# Altium schematic sheet 发送端V03.SchDoc
size A3
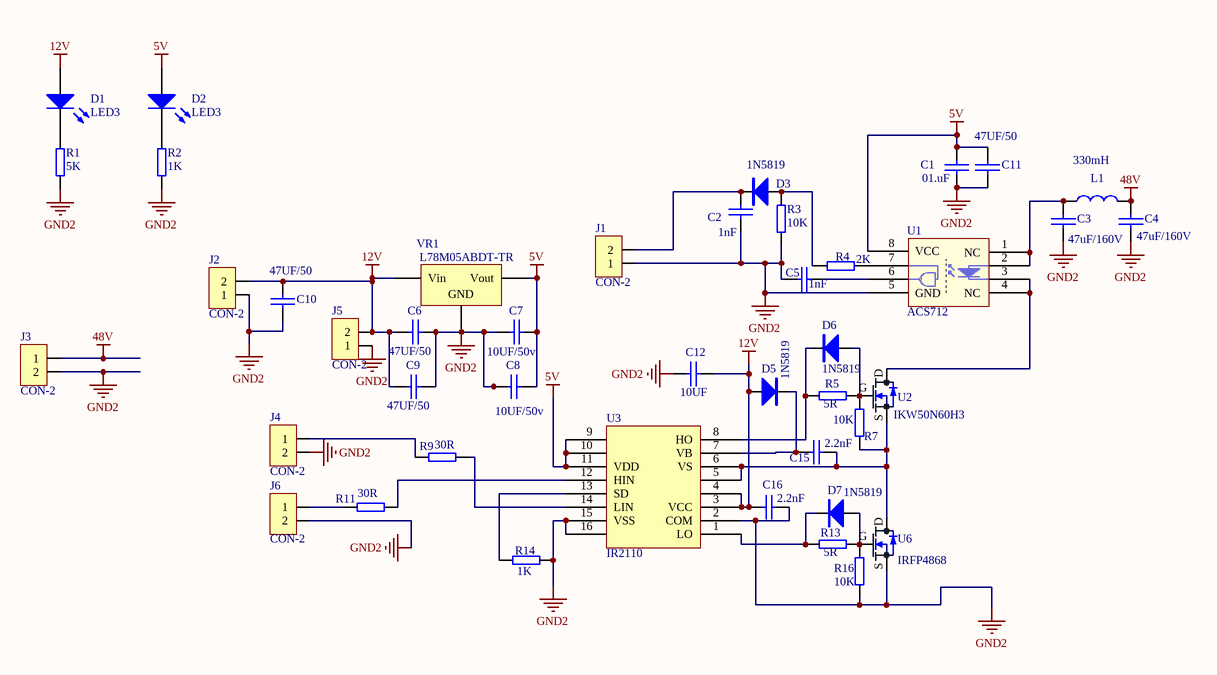
[diagram p0: 发送端V03.SchDoc]

## Parts
C1  01.uF  [1206_C]
C2  1nF  [1206_C]
C3  47uF/160V  [C3618]
C4  47uF/160V  [C3618]
C5  1nF  [1206_C]
C6  47UF/50  [1206_C]
C7  10UF/50v  [1206_C]
C8  10UF/50v  [1206_C]
C9  47UF/50  [1206_C]
C10  47UF/50  [C1020]
C11  47UF/50  [C1020]
C12  10UF  [1206_C]
C15  2.2nF  [1206_C]
C16  2.2nF  [1206_C]
D1  LED3  [1206_R]
D2  LED3  [1206_R]
D3  1N5819  [1206_R]
D5  1N5819  [1206_R]
D6  1N5819  [1206_R]
D7  1N5819  [1206_R]
J1  CON-2  [HDR1X2]
J2  CON-2  [HDR1X2]
J3  CON-2  [F396P2-1]
J4  CON-2  [GPSPIN]
J5  CON-2  [F396P2-1]
J6  CON-2  [GPSPIN]
L1  330mH  [H3.3]
R1  5K  [1206_R]
R2  1K  [1206_R]
R3  10K  [1206_R]
R4  2K  [1206_R]
R5  5R  [1206_R]
R7  10K  [1206_R]
R9  30R  [1206_R]
R11  30R  [1206_R]
R13  5R  [1206_R]
R14  1K  [1206_R]
R16  10K  [1206_R]
U1  ACS712  [SOIC-8_150mil]
U2  IKW50N60H3  [TO-274]
U3  IR2110  [SOIC-16_300mil]
U6  IRFP4868  [TO-274]
VR1  L78M05ABDT-TR  [TO-220]

## Nets
5V: C1.1 C7.1 C8.1 C11.1 D2.1(A) U1.8(VCC) U3.9 U3.10 U3.11(VDD) VR1.S(Vout)
12V: C6.2 C9.2 C10.1 C12.1 C16.2 D1.1(A) D5.1(A) J2.2 J5.2 U3.3(VCC) U3.4 VR1.G(Vin)
48V: C4.1 J3.1 L1.1
GND2: C1.2 C2.2 C3.2 C4.2 C5.2 C6.1 C7.2 C8.2 C9.1 C10.2 C11.2 C12.2 C16.1 J1.1 J2.1 J3.2 J4.2 J5.1 J6.2 R1.1 R2.1 R3.2 R14.2 R16.1 U1.5(GND) U3.2(COM) U3.15(VSS) U3.16 U6.S VR1.D(GND)
NetC2_1: C2.1 D3.2(K) J1.2
NetC3_1: C3.1 L1.2 U1.1(NC) U1.2(A)
NetC5_1: C5.1 U1.6(VO)
NetC15_1: C15.1 R7.1 U2.S U3.5 U3.6(VS) U6.D
NetC15_2: C15.2 D5.2(K) U3.7(VB)
NetD1_2: D1.2(K) R1.2
NetD2_2: D2.2(K) R2.2
NetD3_1: D3.1(A) R3.1 R4.2
NetD6_1: D6.1(A) R5.2 R7.2 U2.G
NetD6_2: D6.2(K) R5.1 U3.8(HO)
NetD7_1: D7.1(A) R13.2 R16.2 U6.G
NetD7_2: D7.2(K) R13.1 U3.1(LO)
NetJ4_1: J4.1 R9.1
NetJ6_1: J6.1 R11.1
NetR4_1: R4.1 U1.7(VE)
NetR9_2: R9.2 U3.14(LIN)
NetR11_2: R11.2 U3.12(HIN)
NetR14_1: R14.1 U3.13(SD)
NetU1_3: U1.3(K) U1.4(NC) U2.D

## Library data of the parts
C1-C12 C15 C16 = CAP
D1 D2 = LED3: Typical BLUE SiC LED; Published: 8-Jun-2000; LatestRevisionDate: 17-Dec-2003; LatestRevisionNote: PCB Footprint replaced.; DatasheetVersion: 16-Apr-2002; PackageVersion: 16-Apr-2002; PackageReference: 3.5X2.8X1.9; Publisher: Altium Limited; PackageDescription: SM LED; 2 C-Bend Leads; Body 3.5 x 2.8 x 1.9 mm, inc leads (LxWxH typ)
D3 D5-D7 = 1N4148: 1N4148WS IN4148 0805 SOD323 丝印T4 贴片开关二极管
L1 = INL: CD75--2.2mH 222M 贴片功率电感绕线功率电感 7*7.8*5mm
R1-R5 R7 R9 R11 R13 R14 R16 = RES
U1 = 6N137S(TA)_[C16496]: 贴片光耦; ComponentLink1Description: 供应商链接; ComponentLink1URL: http://www.szlcsc.com/product/details_17178.html; Package: SMD-8_6.3mm; Supplier: LC; SuppliersPartNumber: C16496
U2 U6 = NMOS
VR1 = TO-252-2 L78M05ABDT-TR: 低压差线性稳压(LDO); ComponentLink1Description: 供应商链接; ComponentLink1URL: http://www.szlcsc.com/product/details_59107.html; Package: TO-252-2; Supplier: LC; SuppliersPartNumber: C58069